# EAGLE design reader (EAGLE 7.1.0)
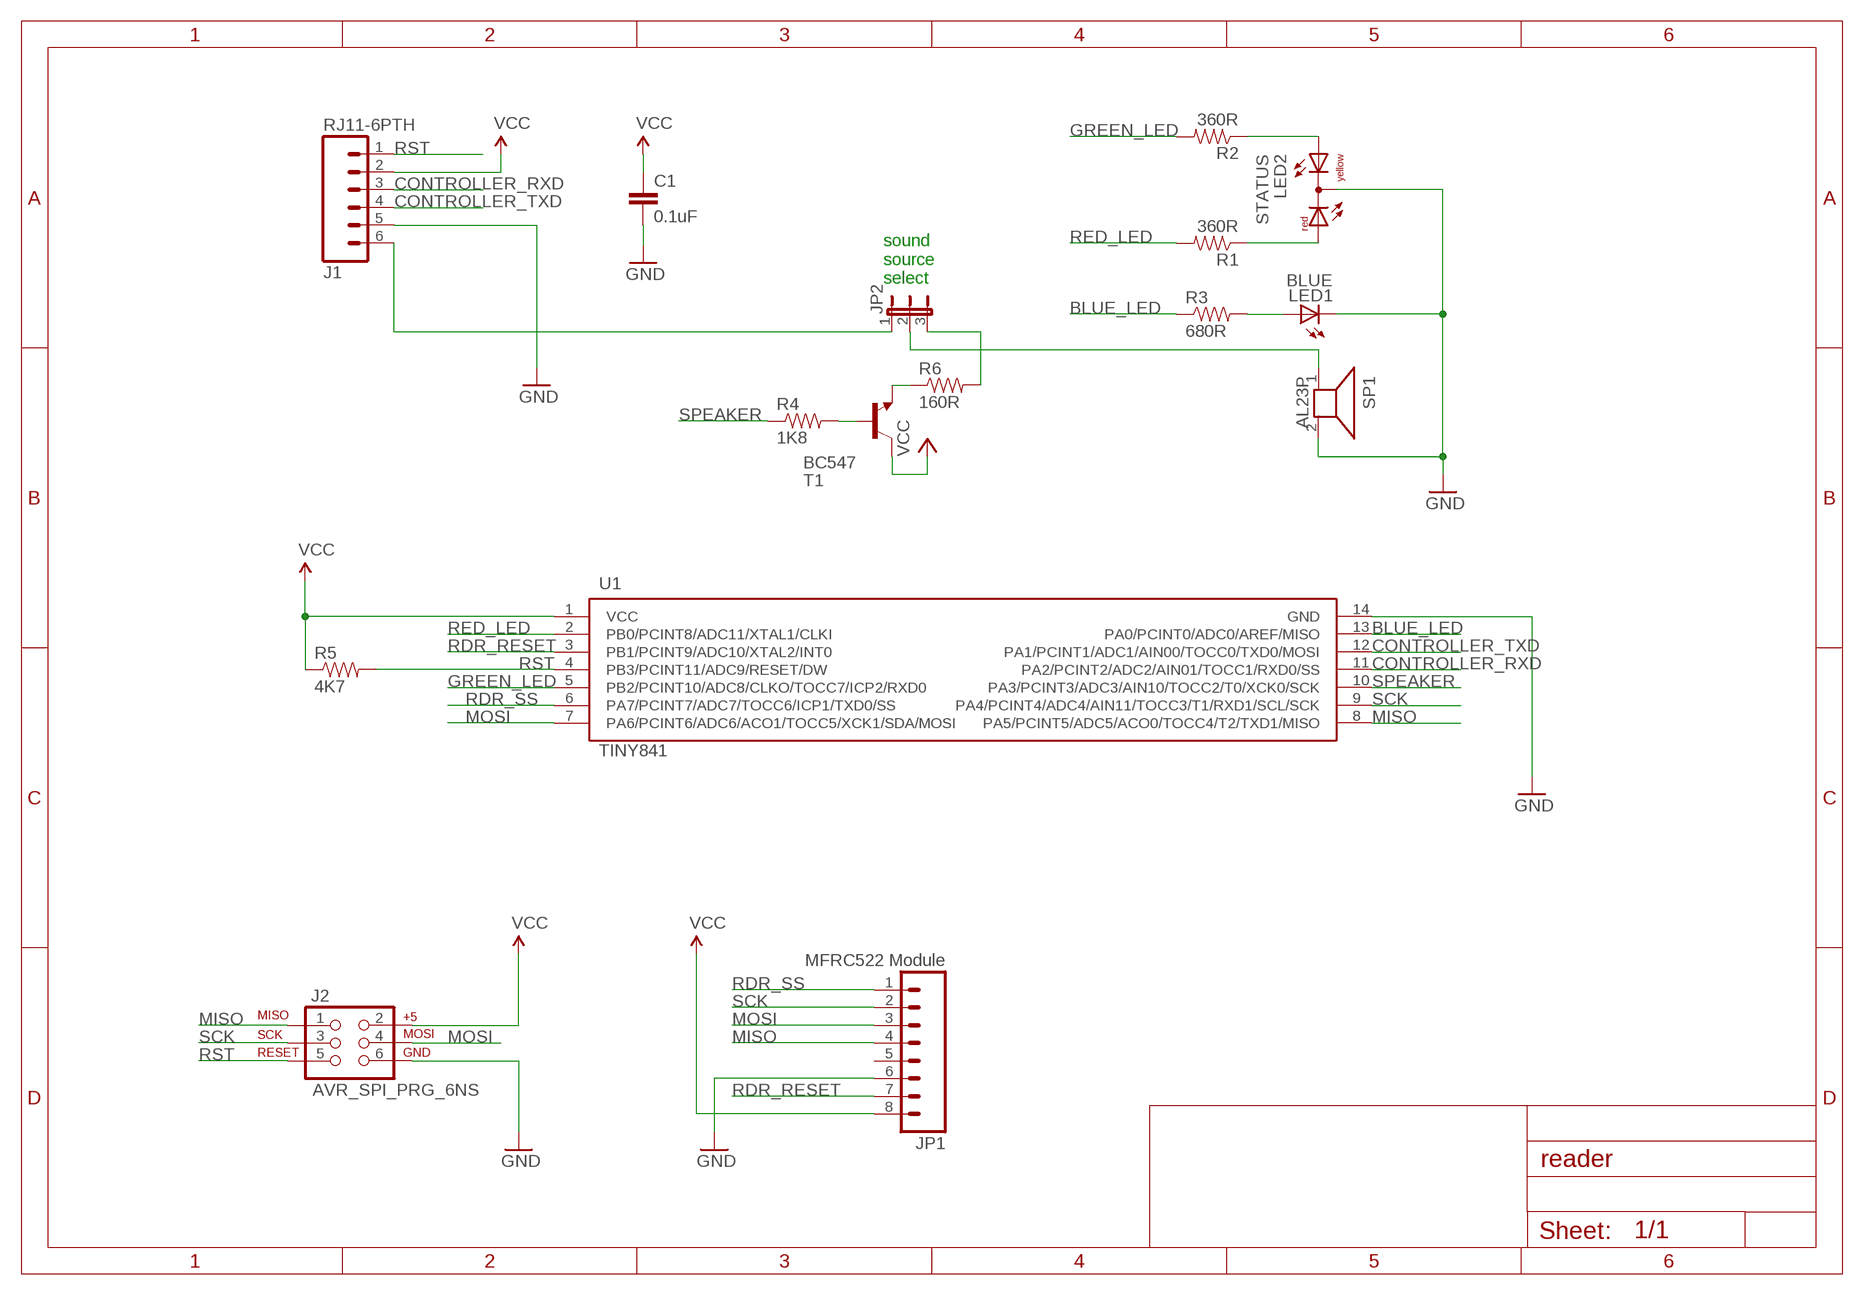
[diagram p0: schematic, sheet 1]

## Parts
C1  0.1uF  0.1UF-50V-20%(PTH)KIT-EZ  [CAP-PTH-SMALL-KIT]
J1  RJ11-6PTH  [RJ11-6]
J2  AVR_SPI_PRG_6NS  [2X3-NS]
JP1  MFRC522 Module  M081X08  [1X08]
JP2  JP2E  [JP2]
LED1  BLUE  LED3MM  [LED3MM]
LED2  STATUS  DUOLED-RY-C  [DUOLED-C-5MM]
R1  360R  RESISTOR0805-RES  [0805]
R2  360R  RESISTOR0805-RES  [0805]
R3  680R  RESISTOR0805-RES  [0805]
R4  1K8  RESISTOR0805-RES  [0805]
R5  4K7  RESISTOR0805-RES  [0805]
R6  160R  RESISTOR0805-RES  [0805]
SP1  AL23P  [AL23P]
T1  BC547  [TO92]
U1  TINY841  [SO14]

## Nets
BLUE_LED: R3.1 U1.13(PA0/PCINT0/ADC0/AREF/MISO)
CONTROLLER_RXD: J1.3 U1.11(PA2/PCINT2/ADC2/AIN01/TOCC1/RXD0/SS)
CONTROLLER_TXD: J1.4 U1.12(PA1/PCINT1/ADC1/AIN00/TOCC0/TXD0/MOSI)
EXT_SPEAKER: J1.6 JP2.1
GND: C1.2 J1.5 J2.6 JP1.6 LED1.K(C) LED2.C SP1.2 U1.14(GND)
GREEN_LED: R2.2 U1.5(PB2/PCINT10/ADC8/CLKO/TOCC7/ICP2/RXD0)
MISO: J2.1 JP1.4 U1.8(PA5/PCINT5/ADC5/ACO0/TOCC4/T2/TXD1/MISO)
MOSI: J2.4 JP1.3 U1.7(PA6/PCINT6/ADC6/ACO1/TOCC5/XCK1/SDA/MOSI)
N$1: JP2.2 SP1.1
N$2: LED2.AR R1.1
N$3: LED2.AX(AY) R2.1
N$4: R4.2 T1.2(B)
N$5: R6.1 T1.1(E)
N$6: LED1.A R3.2
N$7: JP2.3 R6.2
RDR_RESET: JP1.7 U1.3(PB1/PCINT9/ADC10/XTAL2/INT0)
RDR_SS: JP1.1 U1.6(PA7/PCINT7/ADC7/TOCC6/ICP1/TXD0/SS)
RED_LED: R1.2 U1.2(PB0/PCINT8/ADC11/XTAL1/CLKI)
RST: J1.1 J2.5 R5.2 U1.4(PB3/PCINT11/ADC9/RESET/DW)
SCK: J2.3 JP1.2 U1.9(PA4/PCINT4/ADC4/AIN11/TOCC3/T1/RXD1/SCL/SCK)
SPEAKER: R4.1 U1.10(PA3/PCINT3/ADC3/AIN10/TOCC2/T0/XCK0/SCK)
VCC: C1.1 J1.2 J2.2 JP1.8 R5.1 T1.3(C) U1.1(VCC)
Unconnected: JP1.5

## Notes on the sheet
- sound
  source
  select

## Library data of the parts
C1 = SparkFun-Capacitors:0.1UF-50V-20%(PTH): CAP-08370; PROD_ID: CAP-08370
J1 = SparkFun-Connectors:RJ11-6: RJ11 Jack Simple 6 pin RJ11 jack. Commonly found on CAT3 devices and Microchip programmers. SKU: PRT-00132
J2 = SparkFun-Connectors:AVR_SPI_PRG_6: AVR ISP 6 Pin This is the reduced ISP connector for AVR programming. Common on Arduino. This footprint will take up less PCB space and can be used with a 10-pin to 6-pin adapter such as SKU: BOB-08508 **Special note about "TEST_POINT" package. The stop mask is on the top side, so if you want your programming test points to be on the bottom of your board, make sure to place this package on the bottom side of the board. This also ensure that the orientation to program from the bottom side will be correct.
JP1 = SparkFun-Connectors:M08: Header 8 Standard 8-pin 0.1" header. Use with straight break away headers (SKU : PRT-00116), right angle break away headers (PRT-00553), swiss pins (PRT-00743), machine pins (PRT-00117), and female headers (PRT-00115).
JP2 = jumper:JP2E: JUMPER
LED1 = led:LED: LED OSRAM: - CHIPLED LG R971, LG N971, LY N971, LG Q971, LY Q971, LO R971, LY R971 LH N974, LH R974 LS Q976, LO Q976, LY Q976 LO Q996 - Hyper CHIPLED LW Q18S LB Q993, LB Q99A, LB R99A - SideLED LS A670, LO A670, LY A670, LG A670, LP A670 LB A673, LV A673, LT A673, LW A673 LH A674 LY A675 LS A676, LA A676, LO A676, LY A676, LW A676 LS A679, LY A679, LG A679 - Hyper Micro SIDELED® LS Y876, LA Y876, LO Y876, LY Y876 LT Y87S - SmartLED LW L88C, LW L88S LB L89C, LB L89S, LG L890 LS L89K, LO L89K, LY L89K LS L896, LA L896, LO L896, LY L896 - TOPLED LS T670, LO T670, LY T670, LG T670, LP T670 LSG T670, LSP T670, LSY T670, LOP T670, LYG T670 LG T671, LOG T671, LSG T671 LB T673, LV T673, LT T673, LW T673 LH T674 LS T676, LA T676, LO T676, LY T676, LB T676, LH T676, LSB T676, LW T676 LB T67C, LV T67C, LT T67C, LS T67K, LO T67K, LY T67K, LW E67C LS E67B, LA E67B, LO E67B, LY E67B, LB E67C, LV E67C, LT E67C LW T67C LS T679, LY T679, LG T679 LS T770, LO T770, LY T770, LG T770, LP T770 LB T773, LV T773, LT T773, LW T773 LH T774 LS E675, LA E675, LY E675, LS T675 LS T776, LA T776, LO T776, LY T776, LB T776 LHGB T686 LT T68C, LB T68C - Hyper Mini TOPLED® LB M676 - Mini TOPLED Santana® LG M470 LS M47K, LO M47K, LY M47K Source: http://www.osram.convergy.de LUXEON: - LUMILED® LXK2-PW12-R00, LXK2-PW12-S00, LXK2-PW14-U00, LXK2-PW14-V00 LXK2-PM12-R00, LXK2-PM12-S00, LXK2-PM14-U00 LXK2-PE12-Q00, LXK2-PE12-R00, LXK2-PE12-S00, LXK2-PE14-T00, LXK2-PE14-U00 LXK2-PB12-K00, LXK2-PB12-L00, LXK2-PB12-M00, LXK2-PB14-N00, LXK2-PB14-P00, LXK2-PB14-Q00 LXK2-PR12-L00, LXK2-PR12-M00, LXK2-PR14-Q00, LXK2-PR14-R00 LXK2-PD12-Q00, LXK2-PD12-R00, LXK2-PD12-S00 LXK2-PH12-R00, LXK2-PH12-S00 LXK2-PL12-P00, LXK2-PL12-Q00, LXK2-PL12-R00 Source: www.luxeon.com KINGBRIGHT: KA-3528ASYC Source: www.kingbright.com
LED2 = led:DUOLED-RY-C: DUO LED 2 colors (red/yellow), 5 mm, round, common Cathode www.ligitek.com or other producers.
R1-R6 = SparkFun-Passives:RESISTOR: Resistor Basic schematic elements and footprints for 0603, 1206, and PTH resistors.
SP1 = buzzer:AL23P: SPEAKER Source: Buerklin; OC_FARNELL: unknown; OC_NEWARK: unknown
T1 = transistor:BC547: NPN TRANSISTOR
U1 = attiny841:TINY841

## Net classes
0 default: width 0.33 mm, drill 0.381 mm

## Board
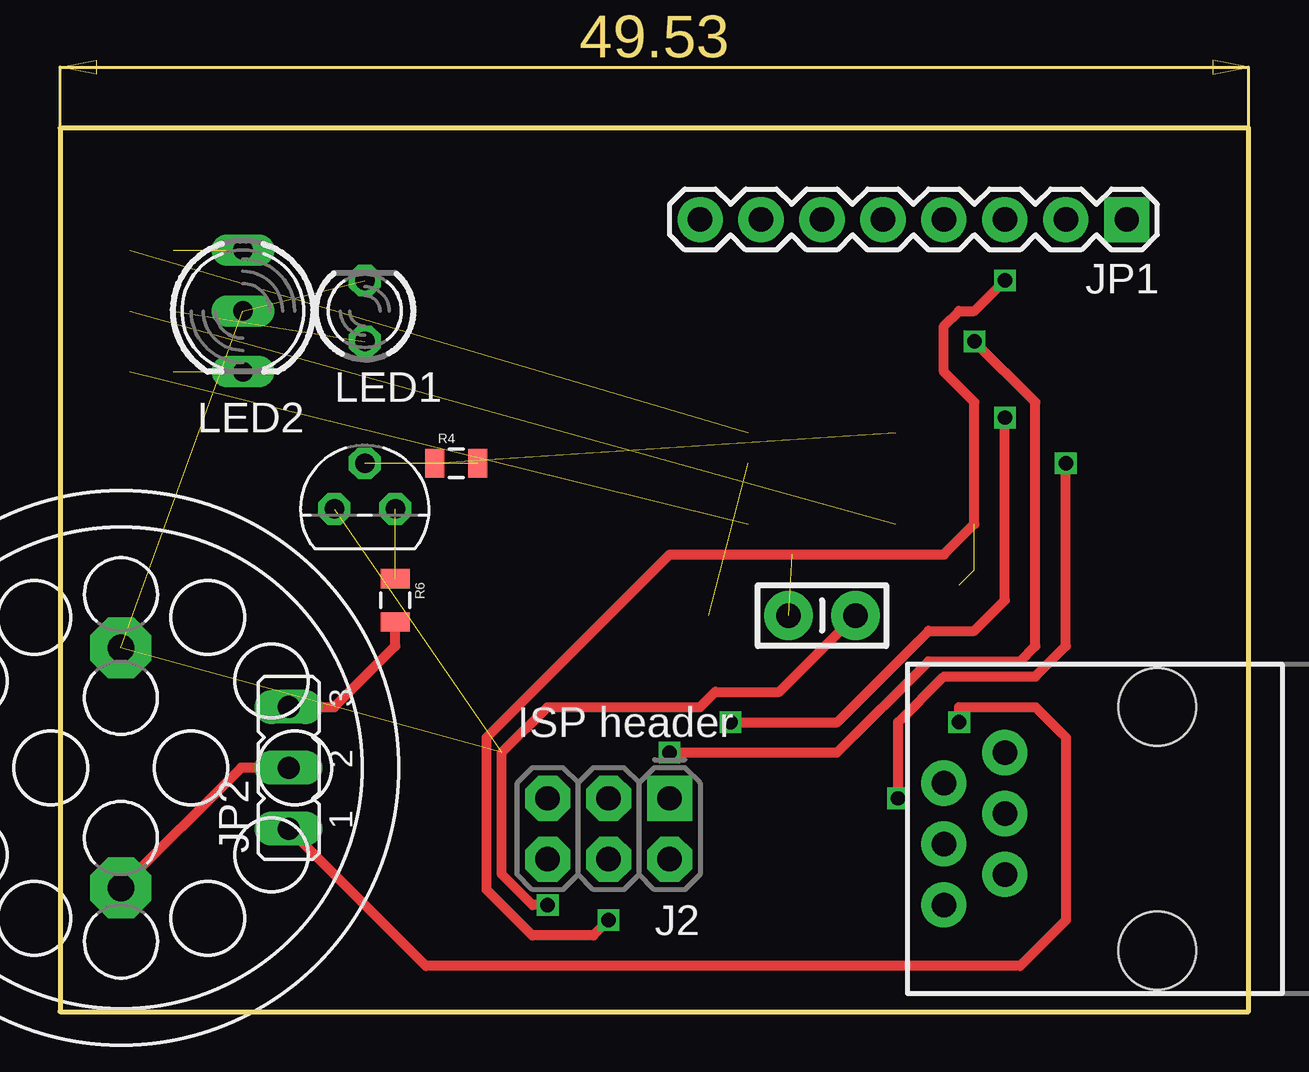
[diagram p1: board, top side]
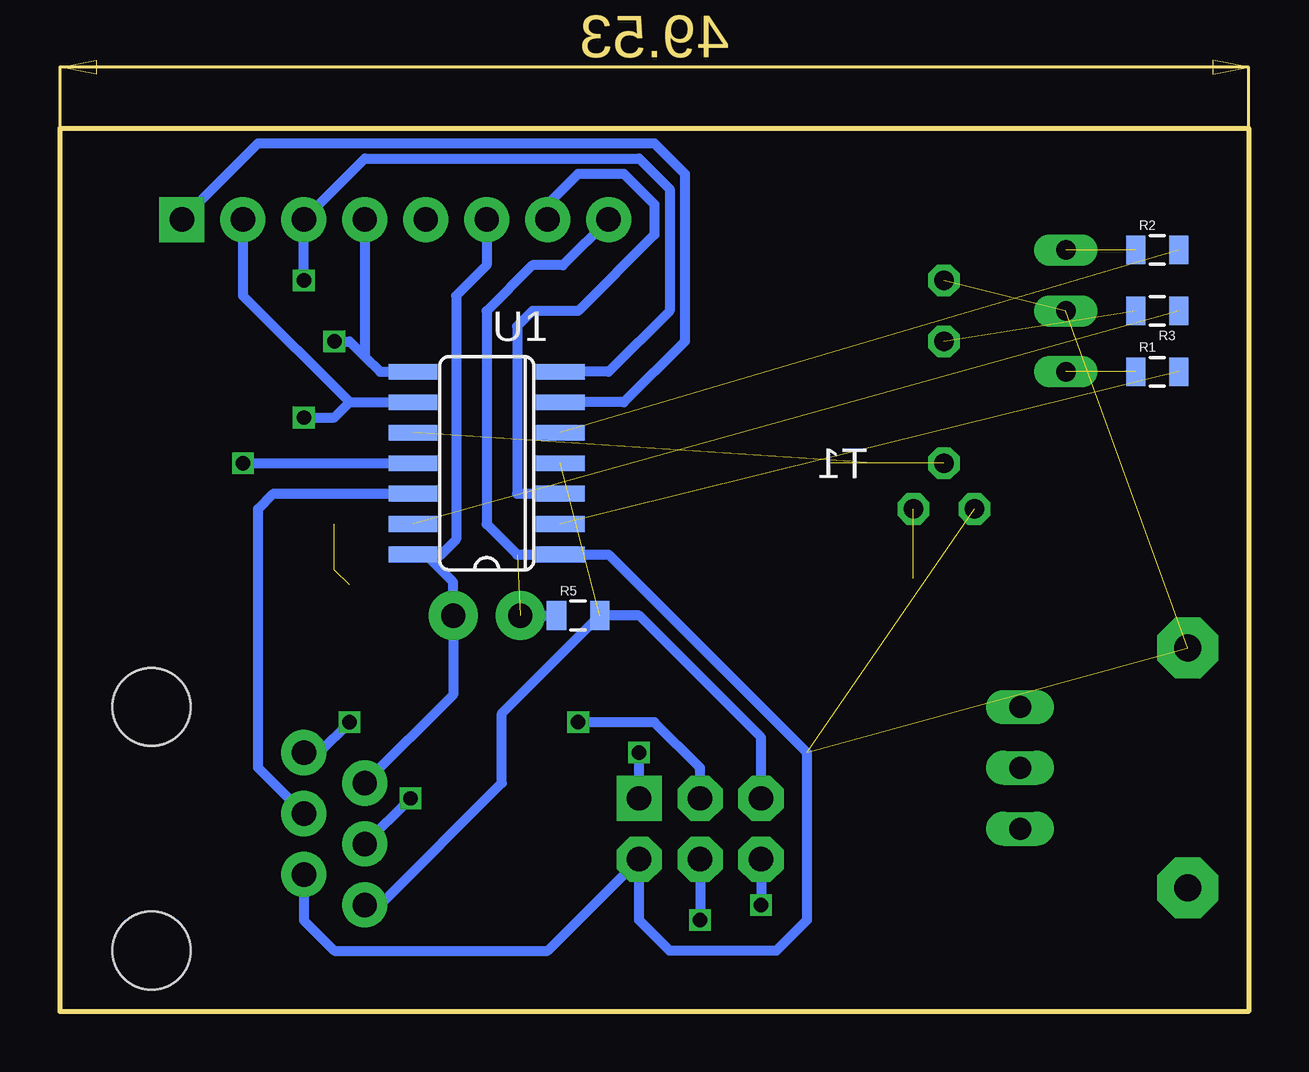
[diagram p2: board, bottom side, seen from below]

Size 49.53 x 36.83 mm. Coordinates in mm from the lower left corner, seen from the top.
Outline: 0,0 49.53,0 49.53,36.83 0,36.83 0,0
Copper layers (1*16): Top 0.035mm / dielectric 1.5mm / Bottom 0.035mm
Design rules "SeeedStudio_2layer_DRU_no_angle_20140221": minimum track width 6mil, minimum drill 12mil, track to track 6mil, track to pad 6mil, pad to pad 6mil, via to via 6mil, smd to smd 0mil, copper to edge 10mil, drill to drill 10mil, minimum pad ring 10mil, minimum via ring 6mil, stop-mask expansion 2mil, vias tented up to drill 100mil, thermal gap 10mil

### Footprints (pad centres in the part's own frame; a part is rotated, then mirrored left to right if it is on the bottom)
CAP-PTH-SMALL-KIT = drill 1.016 pad 2.032: 1 -1.397,0; 2 1.397,0
RJ11-6 = drill 1.016 pad 1.88: 1 1.905,8.89; 2 3.175,6.35; 3 4.445,8.89; 4 5.715,6.35; 5 6.985,8.89; 6 8.255,6.35 | hole 3.251: 0,0; 10.16,0
2X3-NS = drill 1.016 pad 1.88 square: 1 -2.54,-1.27 | drill 1.016 pad 1.88 octagon: 2 -2.54,1.27; 3 0,-1.27; 4 0,1.27; 5 2.54,-1.27; 6 2.54,1.27
1X08 = drill 1.016 pad 1.88 square: 1 0,0 | drill 1.016 pad 1.88: 2 2.54,0; 3 5.08,0; 4 7.62,0; 5 10.16,0; 6 12.7,0; 7 15.24,0; 8 17.78,0
JP2 = drill 0.914 long: 1 -2.54,0; 2 0,0; 3 2.54,0
LED3MM = drill 0.813 octagon: A -1.27,0; K 1.27,0
DUOLED-C-5MM = drill 0.813 long: AR 2.54,0; AX -2.54,0; C 0,0
0805 = smd 0.8 x 1.2: 1 -0.9,0; 2 0.9,0
AL23P = drill 1.118 pad 2.54 octagon: 1 -5.004,0; 2 5.004,0
TO92 = drill 0.813 octagon: 1 1.27,0; 2 0,1.905; 3 -1.27,0
SO14 = smd 0.66 x 2.032: 1 -3.81,-3.073; 2 -2.54,-3.073; 3 -1.27,-3.073; 4 0,-3.073; 5 1.27,-3.073; 6 2.54,-3.073; 7 3.81,-3.073; 8 3.81,3.073; 9 2.54,3.073; 10 1.27,3.073; 11 0,3.073; 12 -1.27,3.073; 13 -2.54,3.073; 14 -3.81,3.073

### Placement (x,y rotation side)
C1  31.75,16.51 0 top
J1  45.72,2.54 90 top
J2  22.86,7.62 180 top
JP1  44.45,33.02 180 top
JP2  9.53,10.16 90 top
LED1  12.7,29.21 90 top
LED2  7.62,29.21 270 top
R1  3.81,26.67 0 bottom
R2  3.81,31.75 0 bottom
R3  3.81,29.21 180 bottom
R4  16.51,22.86 0 top
R5  27.94,16.51 0 bottom
R6  13.97,17.14 270 top
SP1  2.54,10.16 90 top
T1  12.7,20.95 0 top
U1  31.75,22.86 90 bottom

### Tracks (layer width: path | path; a pad name or v marks a point on that pad's centre or on a via)
BLUE_LED  (1 unrouted)
CONTROLLER_RXD  (via drill 0.6)
  Top 0.406: v34.92,8.89 34.92,12.06 36.83,13.97 40.64,13.97 41.91,15.24 v41.91,22.86
  Bottom 0.406: J1.3 v34.92,8.89 | v41.91,22.86 U1.11
CONTROLLER_TXD
  Bottom 0.406: J1.4 41.27,10.16 41.27,20.95 40.64,21.59 U1.12
EXT_SPEAKER  (via drill 0.6)
  Top 0.406: v37.47,12.06 37.47,12.7 40.64,12.7 41.91,11.43 41.91,3.81 40.01,1.91 15.24,1.91 JP2.1
  Bottom 0.406: J1.6 38.73,10.79 v37.47,12.06
GND  (via drill 0.6)  (3 unrouted)
  Top 0.406: v20.32,4.45 19.68,4.45 18.41,5.71 18.41,10.79 20.32,12.7 26.67,12.7 27.3,13.34 29.97,13.34 C1.2
  Bottom 0.406: J1.5 33.15,13.21 C1.2 33.15,17.91 34.29,19.05 U1.14 33.66,19.05 33.02,19.68 33.02,29.84 31.75,31.11 JP1.6 | J2.6 v20.32,4.45
GREEN_LED  (1 unrouted)
MISO  (via drill 0.6)
  Top 0.406: v38.1,27.94 40.64,25.4 40.64,15.24 40.01,14.61 36.2,14.61 32.38,10.79 v25.4,10.79
  Bottom 0.406: JP1.4 36.83,27.3 | 36.83,27.3 36.2,26.67 U1.8 | J2.1 v25.4,10.79 | v38.1,27.94 37.47,27.94 36.83,27.3
MOSI  (via drill 0.6)  (2 unrouted)
  Top 0.406: v22.86,3.81 22.23,3.17 19.68,3.17 17.78,5.08 17.78,11.43 25.4,19.05 36.83,19.05 38.1,20.32 38.1,25.4 36.83,26.67 36.83,28.57 37.47,29.21 38.1,29.21 v39.37,30.48
  Bottom 0.406: U1.7 26.67,26.67 24.13,29.21 24.13,34.29 25.4,35.56 36.83,35.56 JP1.3 v39.37,30.48 | J2.4 v22.86,3.81
N$1
  Top 0.406: JP2.2 7.54,10.16 SP1.1
N$2  (1 unrouted)
N$3  (1 unrouted)
N$4  (1 unrouted)
N$5  (1 unrouted)
N$6  (1 unrouted)
N$7
  Top 0.406: JP2.3 11.43,12.7 13.97,15.24 R6.2
RDR_RESET
  Bottom 0.406: JP1.7 29.21,33.66 27.94,34.92 26.04,34.92 24.77,33.66 24.77,32.38 27.94,29.21 29.84,29.21 30.48,28.57 30.48,21.59 U1.3
RDR_SS
  Bottom 0.406: JP1.1 41.27,36.2 24.77,36.2 23.5,34.92 23.5,27.94 26.04,25.4 U1.6
RED_LED  (1 unrouted)
RST  (1 unrouted)
  Bottom 0.406: J1.1 36.2,4.45 31.11,9.53 31.11,12.44 R5.2 25.4,16.51 20.32,11.43 J2.5
SCK  (via drill 0.6)
  Top 0.406: v27.94,12.06 32.38,12.06 36.2,15.88 38.1,15.88 39.37,17.14 v39.37,24.77
  Bottom 0.406: JP1.2 41.91,29.84 37.47,25.4 | 37.47,25.4 U1.9 | J2.3 22.86,10.16 24.77,12.06 v27.94,12.06 | v39.37,24.77 38.1,24.77 37.47,25.4
SPEAKER  (1 unrouted)
VCC  (2 unrouted)
  Bottom 0.406: C1.1 R5.1 | J1.2 39.37,3.81 38.1,2.54 29.21,2.54 J2.2 25.4,3.81 24.13,2.54 19.68,2.54 18.41,3.81 18.41,10.79 26.67,19.05 U1.1 30.48,19.05 31.75,20.32 31.75,29.21 29.84,31.11 28.57,31.11 JP1.8

### Text on the board
tNames: LED2 | ISP header
tValues: Status | Read
bValues: * *-* internal / *-* * external